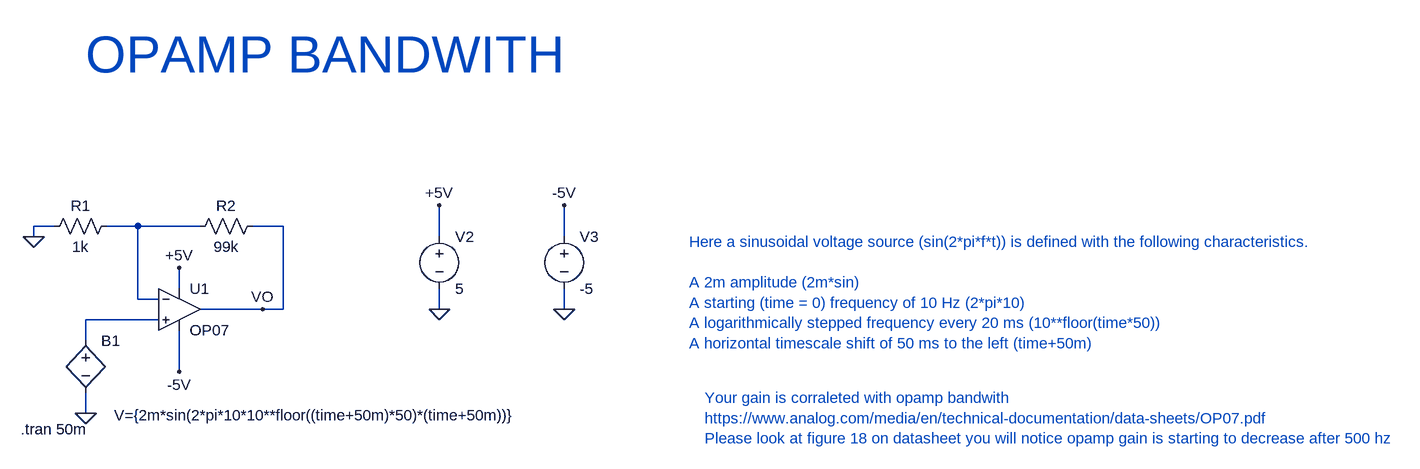
[diagram p0: schematic opampBW.asc]
opampBW.asc, the LTspice schematic file:
Version 4
SHEET 1 2804 680
WIRE -48 48 -80 48
WIRE 80 48 32 48
WIRE 176 48 80 48
WIRE 304 48 256 48
WIRE -80 64 -80 48
WIRE 544 64 544 16
WIRE 736 64 736 16
WIRE 144 144 144 112
WIRE 80 160 80 48
WIRE 112 160 80 160
WIRE 272 176 176 176
WIRE 304 176 304 48
WIRE 304 176 272 176
WIRE 544 176 544 144
WIRE 736 176 736 144
WIRE 112 192 0 192
WIRE 0 224 0 192
WIRE 144 272 144 208
WIRE 0 336 0 304
FLAG 0 336 0
FLAG -80 64 0
FLAG 544 16 +5V
FLAG 544 176 0
FLAG 144 112 +5V
FLAG 272 176 VO
FLAG 736 16 -5V
FLAG 736 176 0
FLAG 144 272 -5V
SYMBOL Opamps\\OP07 144 112 R0
SYMATTR InstName U1
SYMBOL res 48 32 R90
WINDOW 0 0 56 VBottom 2
WINDOW 3 32 56 VTop 2
SYMATTR InstName R1
SYMATTR Value 1k
SYMBOL res 272 32 R90
WINDOW 0 0 56 VBottom 2
WINDOW 3 32 56 VTop 2
SYMATTR InstName R2
SYMATTR Value 99k
SYMBOL voltage 544 48 R0
WINDOW 123 0 0 Left 0
WINDOW 39 0 0 Left 0
SYMATTR InstName V2
SYMATTR Value 5
SYMBOL voltage 736 48 R0
WINDOW 123 0 0 Left 0
WINDOW 39 0 0 Left 0
SYMATTR InstName V3
SYMATTR Value -5
SYMBOL bv 0 208 R0
WINDOW 3 44 131 Left 2
SYMATTR InstName B1
SYMATTR Value V={2m*sin(2*pi*10*10**floor((time+50m)*50)*(time+50m))}
TEXT -100 360 Left 2 !.tran 50m
TEXT 928 72 Left 2 ;Here a sinusoidal voltage source (sin(2*pi*f*t)) is defined with the following characteristics.\n \nA 2m amplitude (2m*sin)\nA starting (time = 0) frequency of 10 Hz (2*pi*10)\nA logarithmically stepped frequency every 20 ms (10**floor(time*50))\nA horizontal timescale shift of 50 ms to the left (time+50m)
TEXT 0 -216 Left 6 ;OPAMP BANDWITH
TEXT 952 312 Left 2 ;Your gain is corraleted with opamp bandwith\nhttps://www.analog.com/media/en/technical-documentation/data-sheets/OP07.pdf\nPlease look at figure 18 on datasheet you will notice opamp gain is starting to decrease after 500 hz

The netlist it stands for:
* opampBW.asc
XU1 N002 N001 +5V -5V VO LT1001  ; OP07, pins In+ In- V+ V- OUT
R1 N001 0 1k
R2 VO N001 99k
V2 +5V 0 5
V3 -5V 0 -5
B1 N002 0 V={2m*sin(2*pi*10*10**floor((time+50m)*50)*(time+50m))}
.tran 50m
* Here a sinusoidal voltage source (sin(2*pi*f*t)) is defined with the following characteristics.
* A 2m amplitude (2m*sin)
* A starting (time = 0) frequency of 10 Hz (2*pi*10)
* A logarithmically stepped frequency every 20 ms (10**floor(time*50))
* A horizontal timescale shift of 50 ms to the left (time+50m)
* OPAMP BANDWITH
* Your gain is corraleted with opamp bandwith
* https://www.analog.com/media/en/technical-documentation/data-sheets/OP07.pdf
* Please look at figure 18 on datasheet you will notice opamp gain is starting to decrease after 500 hz
.lib LTC.lib
.backanno
.end